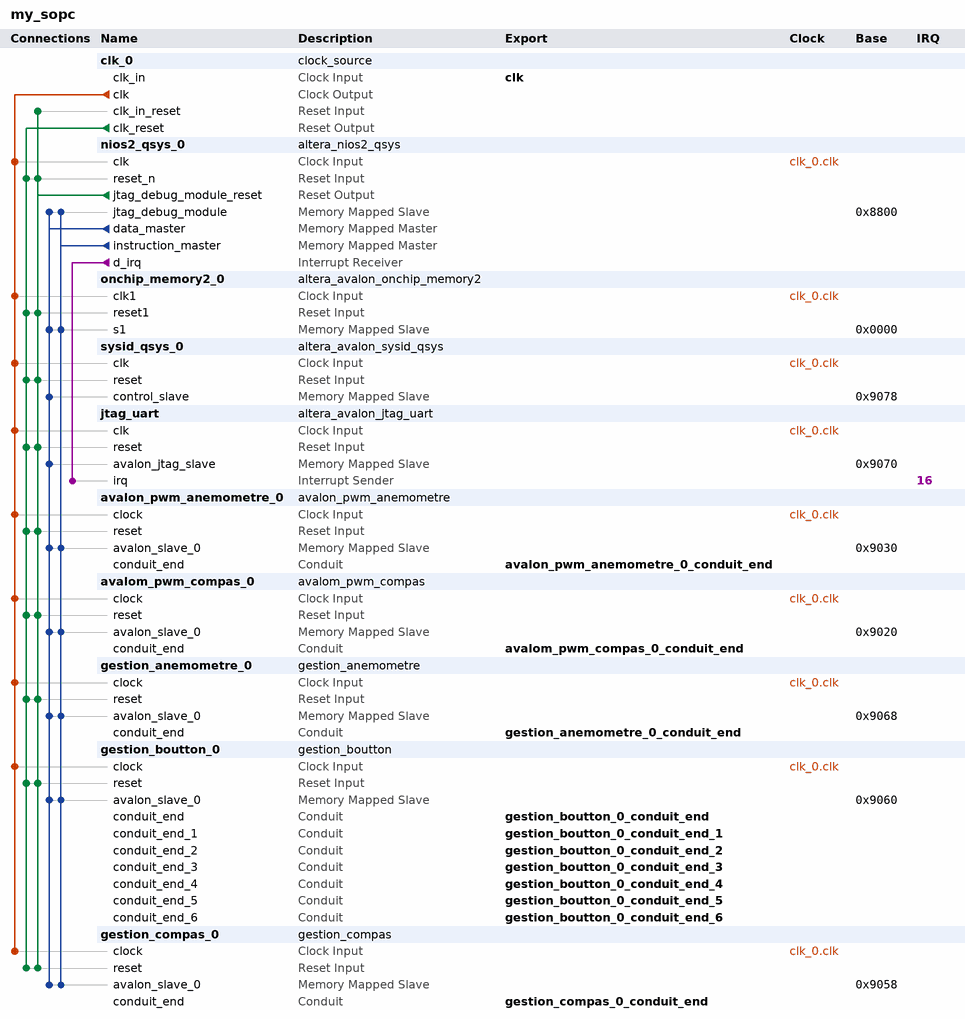
[diagram p0: system contents]
# Platform Designer (Qsys) system my_sopc, Cyclone V 5CGXFC5C6F27C7
# Parameters at their usual value, and those the tool derives, are not listed.
package require -exact qsys 13.0
create_system my_sopc
set_project_property DEVICE_FAMILY {Cyclone V}
set_project_property DEVICE 5CGXFC5C6F27C7

add_instance clk_0 clock_source 13.0
set_instance_parameter_value clk_0 clockFrequency 50000000

add_instance nios2_qsys_0 altera_nios2_qsys 13.0
set_instance_parameter_value nios2_qsys_0 resetSlave onchip_memory2_0.s1
set_instance_parameter_value nios2_qsys_0 mmu_TLBMissExcSlave None
set_instance_parameter_value nios2_qsys_0 exceptionSlave onchip_memory2_0.s1
set_instance_parameter_value nios2_qsys_0 breakSlave nios2_qsys_0.jtag_debug_module
set_instance_parameter_value nios2_qsys_0 impl Tiny
set_instance_parameter_value nios2_qsys_0 icache_size 4096

add_instance onchip_memory2_0 altera_avalon_onchip_memory2 13.0.1.99.2
set_instance_parameter_value onchip_memory2_0 dataWidth 32
set_instance_parameter_value onchip_memory2_0 dualPort false
set_instance_parameter_value onchip_memory2_0 initMemContent true
set_instance_parameter_value onchip_memory2_0 initializationFileName onchip_mem.hex
set_instance_parameter_value onchip_memory2_0 memorySize 20000

add_instance sysid_qsys_0 altera_avalon_sysid_qsys 13.0
set_instance_parameter_value sysid_qsys_0 id 0

add_instance jtag_uart altera_avalon_jtag_uart 13.0.1.99.2
set_instance_parameter_value jtag_uart simInteractiveOptions NO_INTERACTIVE_WINDOWS

add_instance avalon_pwm_anemometre_0 avalon_pwm_anemometre 1.0

add_instance avalom_pwm_compas_0 avalom_pwm_compas 1.0

add_instance gestion_anemometre_0 gestion_anemometre 1.0

add_instance gestion_boutton_0 gestion_boutton 1.0

add_instance gestion_compas_0 gestion_compas 1.0

# connections
add_connection clk_0.clk avalom_pwm_compas_0.clock clock
add_connection clk_0.clk avalon_pwm_anemometre_0.clock clock
add_connection clk_0.clk gestion_anemometre_0.clock clock
add_connection clk_0.clk gestion_boutton_0.clock clock
add_connection clk_0.clk gestion_compas_0.clock clock
add_connection clk_0.clk jtag_uart.clk clock
add_connection clk_0.clk nios2_qsys_0.clk clock
add_connection clk_0.clk onchip_memory2_0.clk1 clock
add_connection clk_0.clk sysid_qsys_0.clk clock
add_connection clk_0.clk_reset avalom_pwm_compas_0.reset reset
add_connection clk_0.clk_reset avalon_pwm_anemometre_0.reset reset
add_connection clk_0.clk_reset gestion_anemometre_0.reset reset
add_connection clk_0.clk_reset gestion_boutton_0.reset reset
add_connection clk_0.clk_reset gestion_compas_0.reset reset
add_connection clk_0.clk_reset jtag_uart.reset reset
add_connection clk_0.clk_reset nios2_qsys_0.reset_n reset
add_connection clk_0.clk_reset onchip_memory2_0.reset1 reset
add_connection clk_0.clk_reset sysid_qsys_0.reset reset
add_connection nios2_qsys_0.jtag_debug_module_reset avalom_pwm_compas_0.reset reset
add_connection nios2_qsys_0.jtag_debug_module_reset avalon_pwm_anemometre_0.reset reset
add_connection nios2_qsys_0.jtag_debug_module_reset clk_0.clk_in_reset reset
add_connection nios2_qsys_0.jtag_debug_module_reset gestion_anemometre_0.reset reset
add_connection nios2_qsys_0.jtag_debug_module_reset gestion_boutton_0.reset reset
add_connection nios2_qsys_0.jtag_debug_module_reset gestion_compas_0.reset reset
add_connection nios2_qsys_0.jtag_debug_module_reset jtag_uart.reset reset
add_connection nios2_qsys_0.jtag_debug_module_reset nios2_qsys_0.reset_n reset
add_connection nios2_qsys_0.jtag_debug_module_reset onchip_memory2_0.reset1 reset
add_connection nios2_qsys_0.jtag_debug_module_reset sysid_qsys_0.reset reset
add_connection nios2_qsys_0.data_master avalom_pwm_compas_0.avalon_slave_0 avalon
set_connection_parameter_value nios2_qsys_0.data_master/avalom_pwm_compas_0.avalon_slave_0 baseAddress 0x9020
add_connection nios2_qsys_0.data_master avalon_pwm_anemometre_0.avalon_slave_0 avalon
set_connection_parameter_value nios2_qsys_0.data_master/avalon_pwm_anemometre_0.avalon_slave_0 baseAddress 0x9030
add_connection nios2_qsys_0.data_master gestion_anemometre_0.avalon_slave_0 avalon
set_connection_parameter_value nios2_qsys_0.data_master/gestion_anemometre_0.avalon_slave_0 baseAddress 0x9068
add_connection nios2_qsys_0.data_master gestion_boutton_0.avalon_slave_0 avalon
set_connection_parameter_value nios2_qsys_0.data_master/gestion_boutton_0.avalon_slave_0 baseAddress 0x9060
add_connection nios2_qsys_0.data_master gestion_compas_0.avalon_slave_0 avalon
set_connection_parameter_value nios2_qsys_0.data_master/gestion_compas_0.avalon_slave_0 baseAddress 0x9058
add_connection nios2_qsys_0.data_master jtag_uart.avalon_jtag_slave avalon
set_connection_parameter_value nios2_qsys_0.data_master/jtag_uart.avalon_jtag_slave baseAddress 0x9070
add_connection nios2_qsys_0.data_master nios2_qsys_0.jtag_debug_module avalon
set_connection_parameter_value nios2_qsys_0.data_master/nios2_qsys_0.jtag_debug_module baseAddress 0x8800
add_connection nios2_qsys_0.data_master onchip_memory2_0.s1 avalon
set_connection_parameter_value nios2_qsys_0.data_master/onchip_memory2_0.s1 baseAddress 0x0000
add_connection nios2_qsys_0.data_master sysid_qsys_0.control_slave avalon
set_connection_parameter_value nios2_qsys_0.data_master/sysid_qsys_0.control_slave baseAddress 0x9078
add_connection nios2_qsys_0.instruction_master avalom_pwm_compas_0.avalon_slave_0 avalon
set_connection_parameter_value nios2_qsys_0.instruction_master/avalom_pwm_compas_0.avalon_slave_0 baseAddress 0x9020
add_connection nios2_qsys_0.instruction_master avalon_pwm_anemometre_0.avalon_slave_0 avalon
set_connection_parameter_value nios2_qsys_0.instruction_master/avalon_pwm_anemometre_0.avalon_slave_0 baseAddress 0x9030
add_connection nios2_qsys_0.instruction_master gestion_anemometre_0.avalon_slave_0 avalon
set_connection_parameter_value nios2_qsys_0.instruction_master/gestion_anemometre_0.avalon_slave_0 baseAddress 0x9068
add_connection nios2_qsys_0.instruction_master gestion_boutton_0.avalon_slave_0 avalon
set_connection_parameter_value nios2_qsys_0.instruction_master/gestion_boutton_0.avalon_slave_0 baseAddress 0x9060
add_connection nios2_qsys_0.instruction_master gestion_compas_0.avalon_slave_0 avalon
set_connection_parameter_value nios2_qsys_0.instruction_master/gestion_compas_0.avalon_slave_0 baseAddress 0x9058
add_connection nios2_qsys_0.instruction_master nios2_qsys_0.jtag_debug_module avalon
set_connection_parameter_value nios2_qsys_0.instruction_master/nios2_qsys_0.jtag_debug_module baseAddress 0x8800
add_connection nios2_qsys_0.instruction_master onchip_memory2_0.s1 avalon
set_connection_parameter_value nios2_qsys_0.instruction_master/onchip_memory2_0.s1 baseAddress 0x0000
add_connection nios2_qsys_0.d_irq jtag_uart.irq interrupt
set_connection_parameter_value nios2_qsys_0.d_irq/jtag_uart.irq irqNumber 16

# exported interfaces
add_interface clk clock sink
set_interface_property clk EXPORT_OF clk_0.clk_in
add_interface avalon_pwm_anemometre_0_conduit_end conduit end
set_interface_property avalon_pwm_anemometre_0_conduit_end EXPORT_OF avalon_pwm_anemometre_0.conduit_end
add_interface avalom_pwm_compas_0_conduit_end conduit end
set_interface_property avalom_pwm_compas_0_conduit_end EXPORT_OF avalom_pwm_compas_0.conduit_end
add_interface gestion_anemometre_0_conduit_end conduit end
set_interface_property gestion_anemometre_0_conduit_end EXPORT_OF gestion_anemometre_0.conduit_end
add_interface gestion_boutton_0_conduit_end conduit end
set_interface_property gestion_boutton_0_conduit_end EXPORT_OF gestion_boutton_0.conduit_end
add_interface gestion_boutton_0_conduit_end_1 conduit end
set_interface_property gestion_boutton_0_conduit_end_1 EXPORT_OF gestion_boutton_0.conduit_end_1
add_interface gestion_boutton_0_conduit_end_2 conduit end
set_interface_property gestion_boutton_0_conduit_end_2 EXPORT_OF gestion_boutton_0.conduit_end_2
add_interface gestion_boutton_0_conduit_end_3 conduit end
set_interface_property gestion_boutton_0_conduit_end_3 EXPORT_OF gestion_boutton_0.conduit_end_3
add_interface gestion_boutton_0_conduit_end_4 conduit end
set_interface_property gestion_boutton_0_conduit_end_4 EXPORT_OF gestion_boutton_0.conduit_end_4
add_interface gestion_boutton_0_conduit_end_5 conduit end
set_interface_property gestion_boutton_0_conduit_end_5 EXPORT_OF gestion_boutton_0.conduit_end_5
add_interface gestion_boutton_0_conduit_end_6 conduit end
set_interface_property gestion_boutton_0_conduit_end_6 EXPORT_OF gestion_boutton_0.conduit_end_6
add_interface gestion_compas_0_conduit_end conduit end
set_interface_property gestion_compas_0_conduit_end EXPORT_OF gestion_compas_0.conduit_end

set_interconnect_requirement {$system} qsys_mm.clockCrossingAdapter HANDSHAKE
set_interconnect_requirement {$system} qsys_mm.maxAdditionalLatency 1

save_system my_sopc.qsys
